# Altium schematic sheet JoystickButtons.SchDoc
size A4
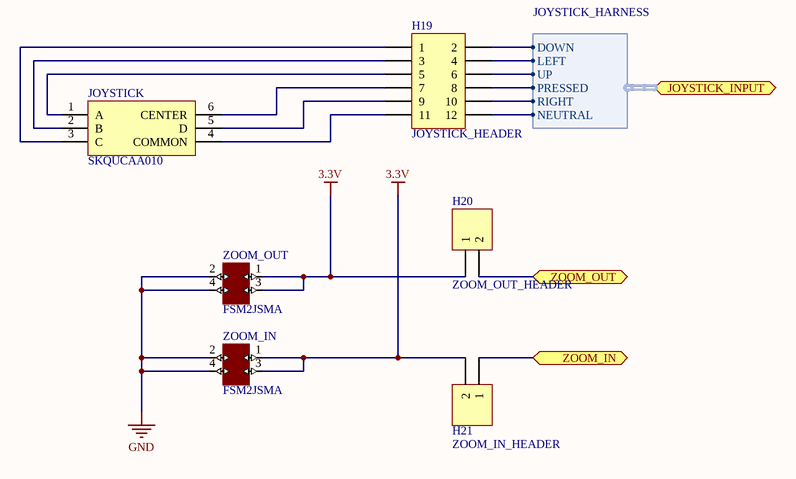
[diagram p0: JoystickButtons.SchDoc]

## Parts
H19  JOYSTICK_HEADER  [HDR2X6]
H20  ZOOM_OUT_HEADER  [HDR1X2]
H21  ZOOM_IN_HEADER  [HDR1X2]
JOYSTICK  SKQUCAA010  [5-WAY-JOYSTICK]
ZOOM_IN  FSM2JSMA  [Button]
ZOOM_OUT  FSM2JSMA  [Button]

## Ports
JOYSTICK_INPUT (harness JOYSTICK_HARNESS), ZOOM_IN, ZOOM_OUT

## Harnesses
JOYSTICK_HARNESS: UP, LEFT, DOWN, NEUTRAL, RIGHT, PRESSED

## Nets
3.3V: H20.1 H21.2 ZOOM_IN.1 ZOOM_IN.3 ZOOM_OUT.1 ZOOM_OUT.3
GND: ZOOM_IN.2 ZOOM_IN.4 ZOOM_OUT.2 ZOOM_OUT.4
ZOOM_IN: H21.1 ; port ZOOM_IN
ZOOM_OUT: H20.2 ; port ZOOM_OUT
NetH19_1: H19.1 JOYSTICK.3(C)
NetH19_2: H19.2 ; port JOYSTICK_INPUT.DOWN
NetH19_3: H19.3 JOYSTICK.2(B)
NetH19_4: H19.4 ; port JOYSTICK_INPUT.LEFT
NetH19_5: H19.5 JOYSTICK.1(A)
NetH19_6: H19.6 ; port JOYSTICK_INPUT.UP
NetH19_7: H19.7 JOYSTICK.6(CENTER)
NetH19_8: H19.8 ; port JOYSTICK_INPUT.PRESSED
NetH19_9: H19.9 JOYSTICK.5(D)
NetH19_10: H19.10 ; port JOYSTICK_INPUT.RIGHT
NetH19_11: H19.11 JOYSTICK.4(COMMON)
NetH19_12: H19.12 ; port JOYSTICK_INPUT.NEUTRAL

## Library data of the parts
H19 = Header 6X2: Header, 6-Pin, Dual row; LatestRevisionDate: 17-Jul-2002; LatestRevisionNote: Re-released for DXP Platform.; Publisher: Altium Limited
H20 H21 = Header 2: Header, 2-Pin; LatestRevisionDate: 17-Jul-2002; LatestRevisionNote: Re-released for DXP Platform.; Publisher: Altium Limited
ZOOM_IN ZOOM_OUT = switch-button